# EAGLE design Display (EAGLE 6.3)
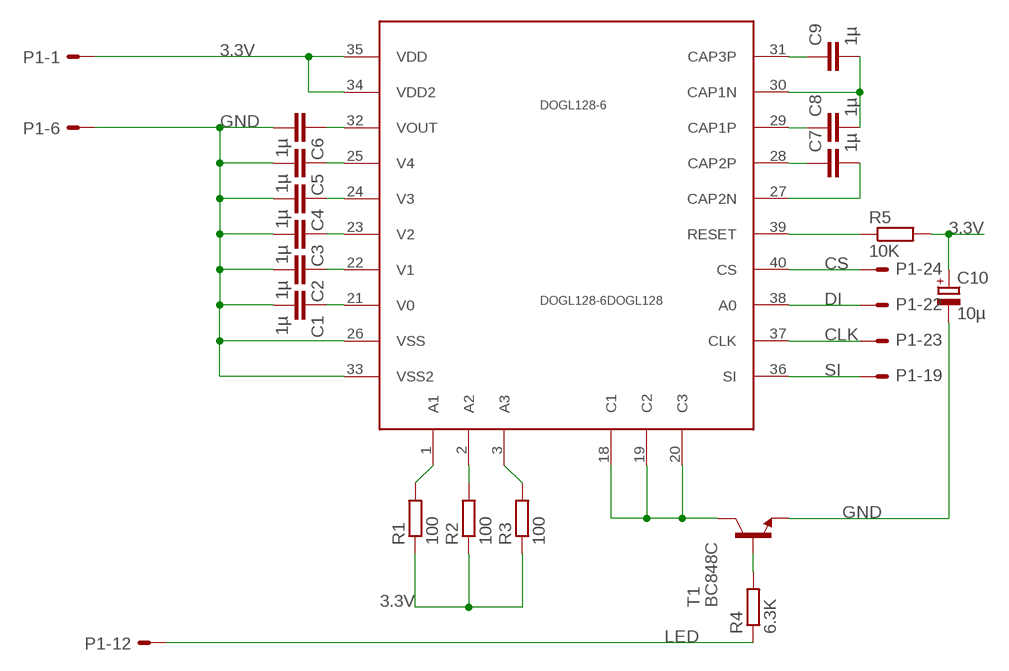
[diagram p0: schematic, sheet 1]

## Parts
C1  1µ  C-EUC1206  [C1206]
C2  1µ  C-EUC1206  [C1206]
C3  1µ  C-EUC1206  [C1206]
C4  1µ  C-EUC1206  [C1206]
C5  1µ  C-EUC1206  [C1206]
C6  1µ  C-EUC1206  [C1206]
C7  1µ  C-EUC1206  [C1206]
C8  1µ  C-EUC1206  [C1206]
C9  1µ  C-EUC1206  [C1206]
C10  10µ  CPOL-EUCT6032  [CT6032]
DOGL128-6  DOGL128-6DOGL128  [DOGL128]
P1  ML26E  [ML26]
R1  100  R-EU_0207/10  [0207/10]
R2  100  R-EU_0207/10  [0207/10]
R3  100  R-EU_0207/10  [0207/10]
R4  6.3K  R-EU_0207/10  [0207/10]
R5  10K  R-EU_0207/12  [0207/12]
T1  BC848C  BC848C-NPN-SOT23-BEC  [SOT23-BEC]

## Nets
3.3V: C10.+ DOGL128-6.34(VDD2) DOGL128-6.35(VDD) P1.1 R1.1 R2.1 R3.1 R5.2
CLK: DOGL128-6.37(CLK) P1.23
CS: DOGL128-6.40(CS) P1.24
DI: DOGL128-6.38(A0) P1.22
GND: C1.2 C2.2 C3.2 C4.2 C5.2 C6.2 C10.- DOGL128-6.26(VSS) DOGL128-6.33(VSS2) P1.6 T1.E
LED: P1.12 R4.1
N$1: C6.1 DOGL128-6.32(VOUT)
N$2: C5.1 DOGL128-6.25(V4)
N$3: C4.1 DOGL128-6.24(V3)
N$4: C3.1 DOGL128-6.23(V2)
N$5: C2.1 DOGL128-6.22(V1)
N$6: C1.1 DOGL128-6.21(V0)
N$7: C7.1 DOGL128-6.28(CAP2P)
N$8: C8.1 DOGL128-6.29(CAP1P)
N$9: C9.1 DOGL128-6.31(CAP3P)
N$10: C8.2 C9.2 DOGL128-6.30(CAP1N)
N$11: C7.2 DOGL128-6.27(CAP2N)
N$12: DOGL128-6.1(A1) R1.2
N$13: DOGL128-6.2(A2) R2.2
N$14: DOGL128-6.3(A3) R3.2
N$15: DOGL128-6.18(C1) DOGL128-6.19(C2) DOGL128-6.20(C3) T1.C
N$16: R4.2 T1.B
N$21: DOGL128-6.39(RESET) R5.1
SI: DOGL128-6.36(SI) P1.19
Unconnected: P1.2 P1.3 P1.4 P1.5 P1.7 P1.8 P1.9 P1.10 P1.11 P1.13 P1.14 P1.15 P1.16 P1.17 P1.18 P1.20 P1.21 P1.25 P1.26

## Library data of the parts
C1-C9 = resistor:C-EU: CAPACITOR, European symbol
C10 = resistor:CPOL-EU: POLARIZED CAPACITOR, European symbol
DOGL128-6 = Display:DOGL128-6: Electronic Assembly DOGL128 display series.
P1 = Display:ML26E: HARTING; OC_FARNELL: unknown; OC_NEWARK: unknown
R1-R5 = resistor:R-EU_: RESISTOR, European symbol
T1 = transistor:*-NPN-: NPN Transistror BF959 corrected 2008.03.06

## Board
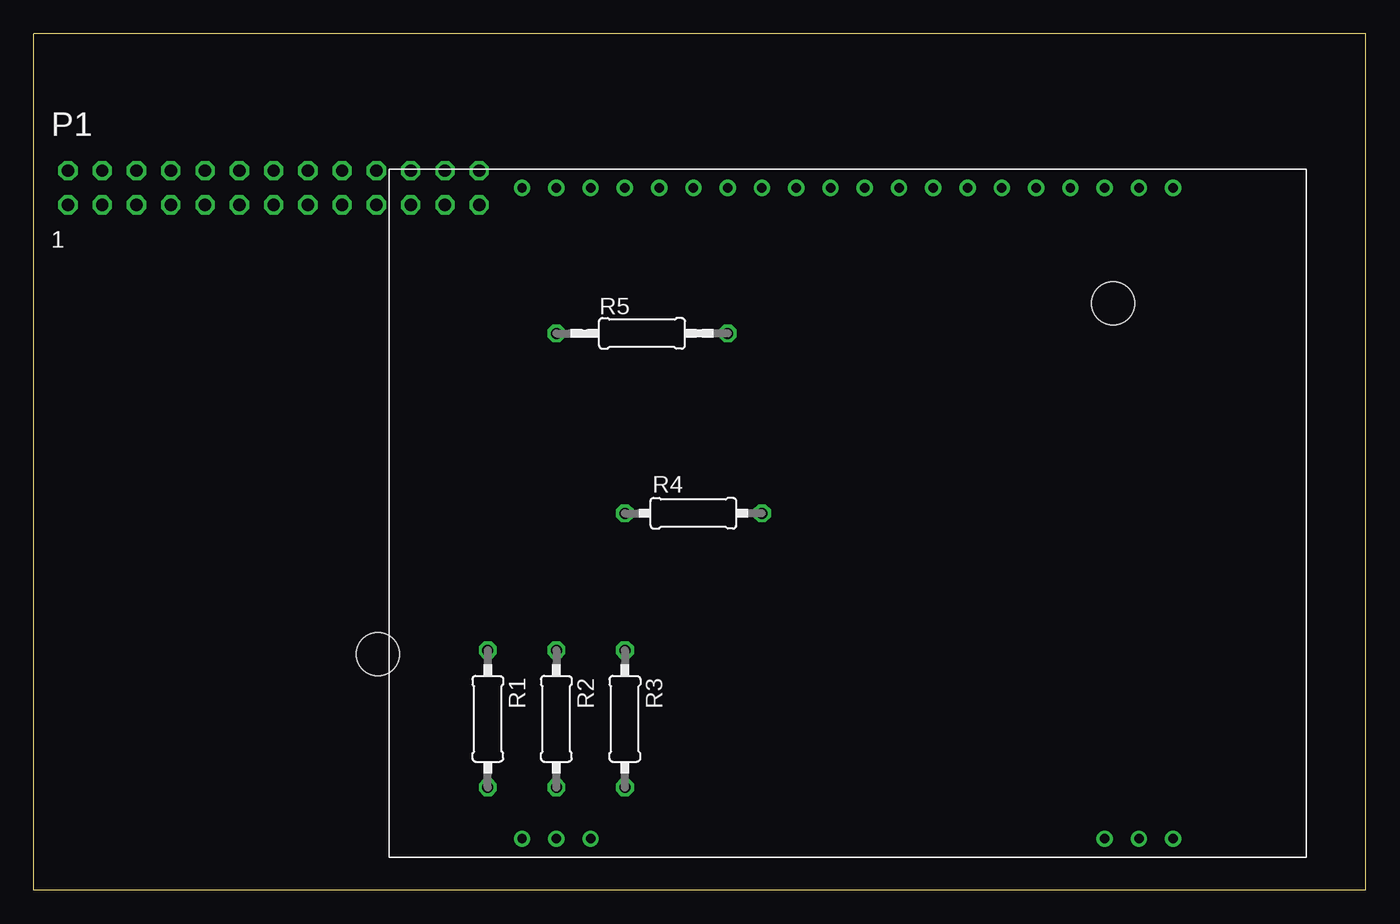
[diagram p1: board, top side]
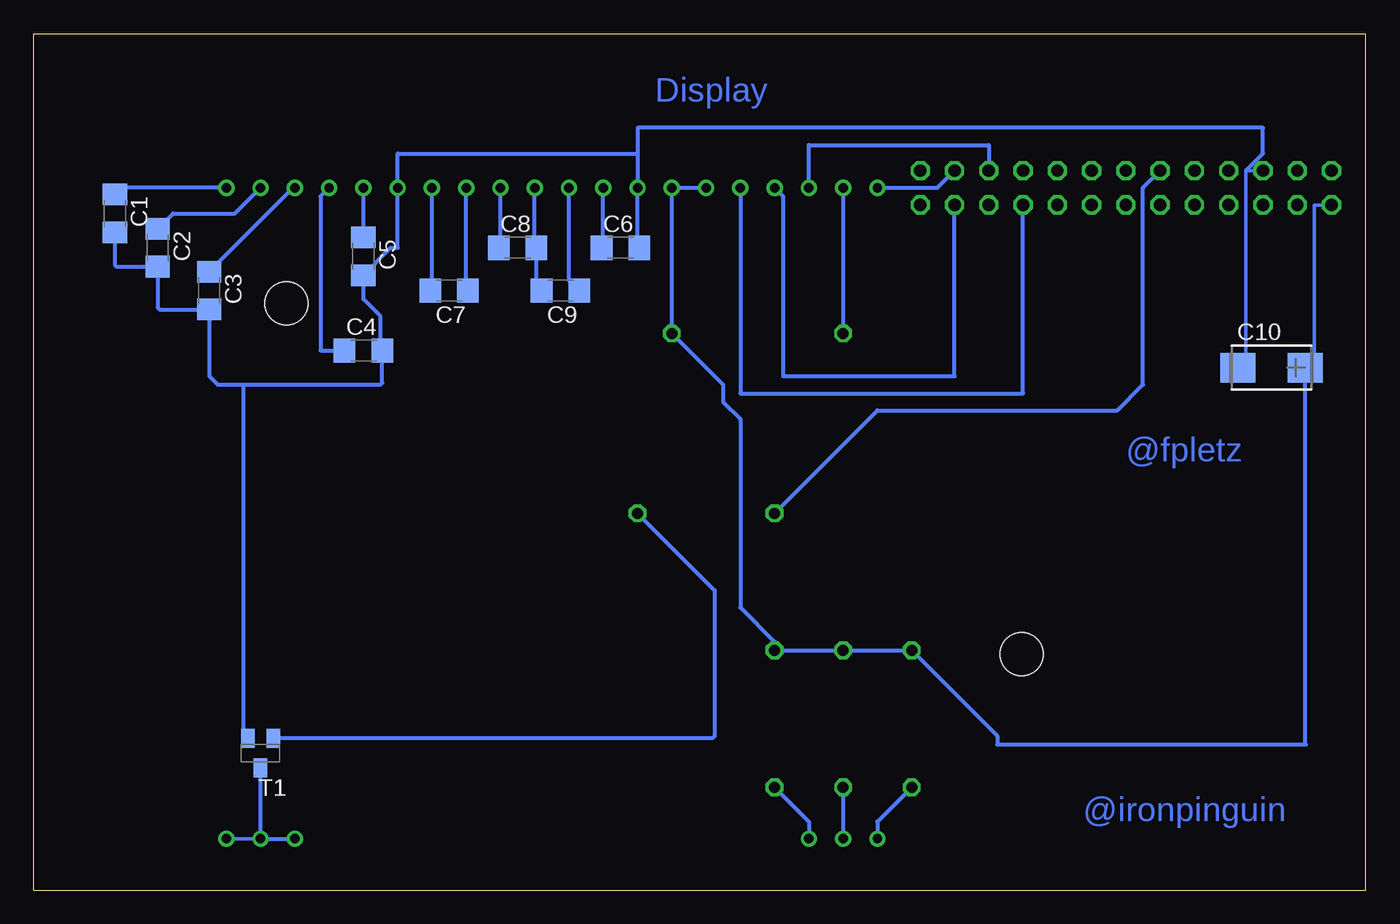
[diagram p2: board, bottom side, seen from below]

Size 98.73 x 63.49 mm. Coordinates in mm from the lower left corner, seen from the top.
Outline: 98.73,0 98.73,63.49 0,63.49 0,0 98.73,0
Copper layers (1*16): Top 0.035mm / dielectric 1.5mm / Bottom 0.035mm
Design rules "default": minimum track width 10mil, minimum drill 24mil, track to track 8mil, track to pad 8mil, pad to pad 8mil, via to via 8mil, smd to smd 8mil, copper to edge 40mil, drill to drill 8mil, minimum pad ring 10mil, minimum via ring 8mil, stop-mask expansion 4mil, vias tented up to drill 0mil, thermal gap 10mil
Holes 3.2 mm at 25.5,17.5 80,43.5

### Footprints (pad centres in the part's own frame; a part is rotated, then mirrored left to right if it is on the bottom)
C1206 = smd 1.6 x 1.8: 1 -1.4,0; 2 1.4,0
CT6032 = smd 2.6 x 2.2: + 2.5,0; - -2.5,0
DOGL128 = drill 0.7: 1 -24.13,-24.13; 2 -21.59,-24.13; 3 -19.05,-24.13; 18 19.05,-24.13; 19 21.59,-24.13; 20 24.13,-24.13; 21 24.13,24.13; 22 21.59,24.13; 23 19.05,24.13; 24 16.51,24.13; 25 13.97,24.13; 26 11.43,24.13; 27 8.89,24.13; 28 6.35,24.13; 29 3.81,24.13; 30 1.27,24.13; 31 -1.27,24.13; 32 -3.81,24.13; 33 -6.35,24.13; 34 -8.89,24.13; 35 -11.43,24.13; 36 -13.97,24.13; 37 -16.51,24.13; 38 -19.05,24.13; 39 -21.59,24.13; 40 -24.13,24.13
ML26 = drill 0.914 octagon: 1 -15.24,-1.27; 2 -15.24,1.27; 3 -12.7,-1.27; 4 -12.7,1.27; 5 -10.16,-1.27; 6 -10.16,1.27; 7 -7.62,-1.27; 8 -7.62,1.27; 9 -5.08,-1.27; 10 -5.08,1.27; 11 -2.54,-1.27; 12 -2.54,1.27; 13 0,-1.27; 14 0,1.27; 15 2.54,-1.27; 16 2.54,1.27; 17 5.08,-1.27; 18 5.08,1.27; 19 7.62,-1.27; 20 7.62,1.27; 21 10.16,-1.27; 22 10.16,1.27; 23 12.7,-1.27; 24 12.7,1.27; 25 15.24,-1.27; 26 15.24,1.27
0207/10 = drill 0.813 octagon: 1 -5.08,0; 2 5.08,0
0207/12 = drill 0.813 octagon: 1 -6.35,0; 2 6.35,0
SOT23-BEC = smd 1 x 1.4: B -0.95,-1.1; C 0,1.1; E 0.95,-1.1

### Placement (x,y rotation side)
C1  92.71,50.16 270 bottom
C2  89.53,47.62 270 bottom
C3  85.72,44.45 270 bottom
C4  74.3,40.01 0 bottom
C5  74.3,46.99 270 bottom
C6  55.24,47.62 0 bottom
C7  67.94,44.45 180 bottom
C8  62.87,47.62 0 bottom
C9  59.69,44.45 180 bottom
C10  6.99,38.73 0 bottom
DOGL128-6  60.33,27.94 0 top
P1  17.78,52.07 0 top
R1  33.66,12.7 270 top
R2  38.73,12.7 270 top
R3  43.81,12.7 270 top
R4  48.9,27.94 0 top
R5  45.09,41.27 0 top
T1  81.92,10.16 180 bottom

### Tracks (layer width: path | path; a pad name or v marks a point on that pad's centre or on a via)
3.3V
  Bottom 0.254: P1.1 3.81,50.8 3.81,39.37 C10.+
  Bottom 0.305: DOGL128-6.35 DOGL128-6.34 R5.2 47.62,37.47 47.62,36.2 46.35,34.92 46.35,20.95 43.81,18.41 R3.1 R2.1 R1.1 27.3,11.43 27.3,10.79 4.45,10.79 4.49,10.84 C10.+
CLK
  Bottom 0.305: DOGL128-6.37 43.18,51.44 43.18,38.1 30.48,38.1 P1.23
CS
  Bottom 0.305: DOGL128-6.40 31.75,52.07 P1.24
DI
  Bottom 0.305: DOGL128-6.38 41.27,55.24 27.94,55.24 P1.22
GND
  Bottom 0.254: P1.6 8.89,53.34 8.89,39.37 C10.-
  Bottom 0.305: C1.2 92.71,46.35 92.58,46.23 C2.2 89.53,43.18 89.41,43.05 C3.2 85.72,38.1 85.09,37.47 83.19,37.47 | 83.19,37.47 73.03,37.47 72.89,37.59 C4.2 73.03,40.13 73.03,42.55 74.3,43.81 C5.2 72.26,47.62 71.75,47.62 DOGL128-6.26 71.75,54.61 53.98,54.61 | T1.E 83.19,11.58 83.19,37.47 | C6.2 53.98,47.76 DOGL128-6.33 53.98,53.98 53.98,54.61 | 8.89,53.34 7.62,54.61 7.62,56.52 53.98,56.52 53.98,54.61
LED
  Bottom 0.305: R4.1 36.2,35.56 18.41,35.56 16.51,37.47 16.51,52.07 P1.12
N$1
  Bottom 0.305: C6.1 56.52,47.76 DOGL128-6.32
N$2
  Bottom 0.305: C5.1 DOGL128-6.25
N$3
  Bottom 0.305: DOGL128-6.24 77.47,51.44 77.47,40.01 C4.1
N$4
  Bottom 0.305: C3.1 79.5,52.07 DOGL128-6.23
N$5
  Bottom 0.305: C2.1 88.39,50.16 83.82,50.16 DOGL128-6.22
N$6
  Bottom 0.305: DOGL128-6.21 92.71,52.07 C1.1
N$7
  Bottom 0.305: C7.1 66.67,44.58 DOGL128-6.28
N$8
  Bottom 0.305: C8.1 64.14,47.76 DOGL128-6.29
N$9
  Bottom 0.305: C9.1 59.05,45.22 DOGL128-6.31
N$10
  Bottom 0.305: C9.2 61.47,44.83 C8.2 61.59,47.76 DOGL128-6.30
N$11
  Bottom 0.305: C7.2 69.22,44.58 DOGL128-6.27
N$12
  Bottom 0.305: R1.2 36.2,5.08 DOGL128-6.1
N$13
  Bottom 0.305: R2.2 DOGL128-6.2
N$14
  Bottom 0.305: R3.2 41.27,5.08 DOGL128-6.3
N$15
  Bottom 0.254: DOGL128-6.20 DOGL128-6.19
  Bottom 0.305: DOGL128-6.18 DOGL128-6.19 T1.C
N$16
  Bottom 0.305: R4.2 48.26,22.23 48.26,11.43 48.43,11.26 T1.B
N$21
  Bottom 0.305: DOGL128-6.39 R5.1
SI
  Bottom 0.305: DOGL128-6.36 46.35,36.83 25.4,36.83 P1.19

### Text on the board
Bottom: Display | @fpletz | @ironpinguin